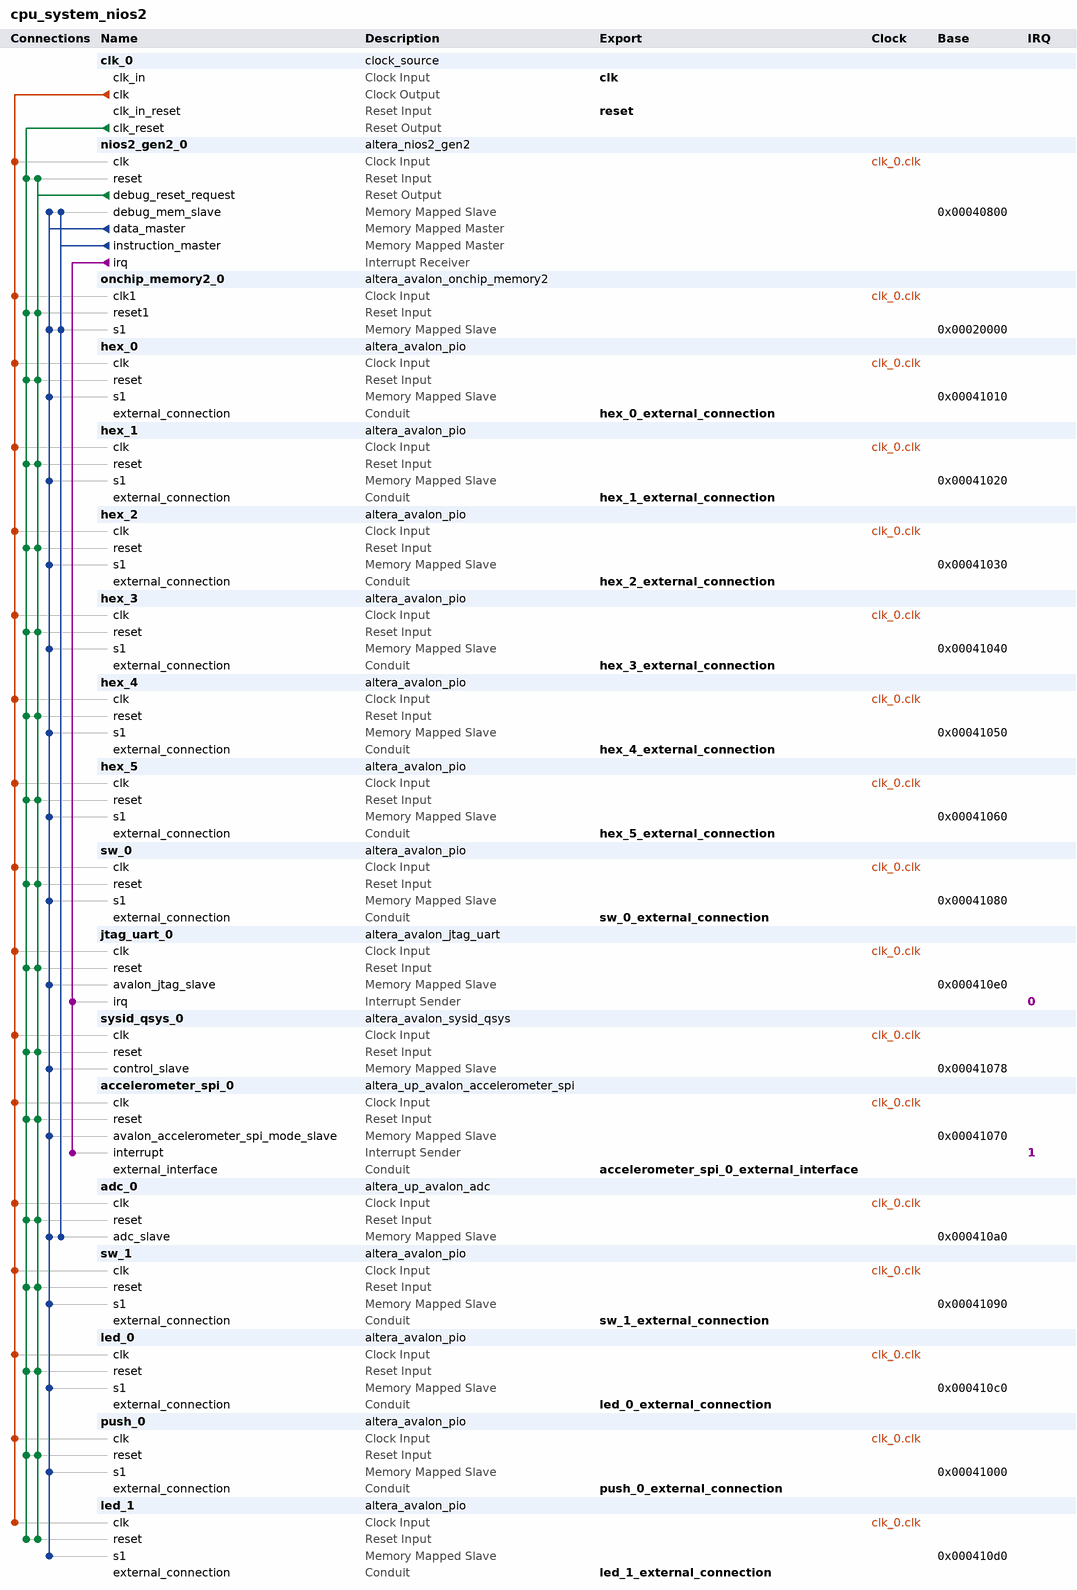
[diagram p0: system contents]
# Platform Designer (Qsys) system cpu_system_nios2, MAX 10 10M50DAF484C7G
# Parameters at their usual value, and those the tool derives, are not listed.
package require -exact qsys 22.1
create_system cpu_system_nios2
set_project_property DEVICE_FAMILY {MAX 10}
set_project_property DEVICE 10M50DAF484C7G

add_instance clk_0 clock_source 22.1
set_instance_parameter_value clk_0 clockFrequency 50000000

add_instance nios2_gen2_0 altera_nios2_gen2 22.1
set_instance_parameter_value nios2_gen2_0 dcache_size 0
set_instance_parameter_value nios2_gen2_0 exceptionSlave onchip_memory2_0.s1
set_instance_parameter_value nios2_gen2_0 icache_size 0
set_instance_parameter_value nios2_gen2_0 impl Fast
set_instance_parameter_value nios2_gen2_0 resetSlave onchip_memory2_0.s1

add_instance onchip_memory2_0 altera_avalon_onchip_memory2 22.1
set_instance_parameter_value onchip_memory2_0 dataWidth 32
set_instance_parameter_value onchip_memory2_0 dualPort false
set_instance_parameter_value onchip_memory2_0 initMemContent false
set_instance_parameter_value onchip_memory2_0 initializationFileName onchip_mem.hex
set_instance_parameter_value onchip_memory2_0 memorySize 131072

add_instance hex_0 altera_avalon_pio 22.1
set_instance_parameter_value hex_0 direction Output
set_instance_parameter_value hex_0 width 8

add_instance hex_1 altera_avalon_pio 22.1
set_instance_parameter_value hex_1 direction Output
set_instance_parameter_value hex_1 width 8

add_instance hex_2 altera_avalon_pio 22.1
set_instance_parameter_value hex_2 direction Output
set_instance_parameter_value hex_2 width 8

add_instance hex_3 altera_avalon_pio 22.1
set_instance_parameter_value hex_3 direction Output
set_instance_parameter_value hex_3 width 8

add_instance hex_4 altera_avalon_pio 22.1
set_instance_parameter_value hex_4 direction Output
set_instance_parameter_value hex_4 width 8

add_instance hex_5 altera_avalon_pio 22.1
set_instance_parameter_value hex_5 direction Output
set_instance_parameter_value hex_5 width 8

add_instance sw_0 altera_avalon_pio 22.1
set_instance_parameter_value sw_0 direction Input
set_instance_parameter_value sw_0 width 10

add_instance jtag_uart_0 altera_avalon_jtag_uart 22.1
set_instance_parameter_value jtag_uart_0 simInteractiveOptions NO_INTERACTIVE_WINDOWS

add_instance sysid_qsys_0 altera_avalon_sysid_qsys 22.1
set_instance_parameter_value sysid_qsys_0 id -559038737

add_instance accelerometer_spi_0 altera_up_avalon_accelerometer_spi 18.0

add_instance adc_0 altera_up_avalon_adc 18.0
set_instance_parameter_value adc_0 board DE10-Lite
set_instance_parameter_value adc_0 numch_ 1
set_instance_parameter_value adc_0 sclk_freq 10.0

add_instance sw_1 altera_avalon_pio 22.1
set_instance_parameter_value sw_1 direction Input
set_instance_parameter_value sw_1 width 10

add_instance led_0 altera_avalon_pio 22.1
set_instance_parameter_value led_0 direction Output
set_instance_parameter_value led_0 width 1

add_instance push_0 altera_avalon_pio 22.1
set_instance_parameter_value push_0 direction Input
set_instance_parameter_value push_0 width 1

add_instance led_1 altera_avalon_pio 22.1
set_instance_parameter_value led_1 direction Output
set_instance_parameter_value led_1 width 1

# connections
add_connection clk_0.clk accelerometer_spi_0.clk clock
add_connection clk_0.clk adc_0.clk clock
add_connection clk_0.clk hex_0.clk clock
add_connection clk_0.clk hex_1.clk clock
add_connection clk_0.clk hex_2.clk clock
add_connection clk_0.clk hex_3.clk clock
add_connection clk_0.clk hex_4.clk clock
add_connection clk_0.clk hex_5.clk clock
add_connection clk_0.clk jtag_uart_0.clk clock
add_connection clk_0.clk led_0.clk clock
add_connection clk_0.clk led_1.clk clock
add_connection clk_0.clk nios2_gen2_0.clk clock
add_connection clk_0.clk onchip_memory2_0.clk1 clock
add_connection clk_0.clk push_0.clk clock
add_connection clk_0.clk sw_0.clk clock
add_connection clk_0.clk sw_1.clk clock
add_connection clk_0.clk sysid_qsys_0.clk clock
add_connection clk_0.clk_reset accelerometer_spi_0.reset reset
add_connection clk_0.clk_reset adc_0.reset reset
add_connection clk_0.clk_reset hex_0.reset reset
add_connection clk_0.clk_reset hex_1.reset reset
add_connection clk_0.clk_reset hex_2.reset reset
add_connection clk_0.clk_reset hex_3.reset reset
add_connection clk_0.clk_reset hex_4.reset reset
add_connection clk_0.clk_reset hex_5.reset reset
add_connection clk_0.clk_reset jtag_uart_0.reset reset
add_connection clk_0.clk_reset led_0.reset reset
add_connection clk_0.clk_reset led_1.reset reset
add_connection clk_0.clk_reset nios2_gen2_0.reset reset
add_connection clk_0.clk_reset onchip_memory2_0.reset1 reset
add_connection clk_0.clk_reset push_0.reset reset
add_connection clk_0.clk_reset sw_0.reset reset
add_connection clk_0.clk_reset sw_1.reset reset
add_connection clk_0.clk_reset sysid_qsys_0.reset reset
add_connection nios2_gen2_0.debug_reset_request accelerometer_spi_0.reset reset
add_connection nios2_gen2_0.debug_reset_request adc_0.reset reset
add_connection nios2_gen2_0.debug_reset_request hex_0.reset reset
add_connection nios2_gen2_0.debug_reset_request hex_1.reset reset
add_connection nios2_gen2_0.debug_reset_request hex_2.reset reset
add_connection nios2_gen2_0.debug_reset_request hex_3.reset reset
add_connection nios2_gen2_0.debug_reset_request hex_4.reset reset
add_connection nios2_gen2_0.debug_reset_request hex_5.reset reset
add_connection nios2_gen2_0.debug_reset_request jtag_uart_0.reset reset
add_connection nios2_gen2_0.debug_reset_request led_0.reset reset
add_connection nios2_gen2_0.debug_reset_request led_1.reset reset
add_connection nios2_gen2_0.debug_reset_request nios2_gen2_0.reset reset
add_connection nios2_gen2_0.debug_reset_request onchip_memory2_0.reset1 reset
add_connection nios2_gen2_0.debug_reset_request push_0.reset reset
add_connection nios2_gen2_0.debug_reset_request sw_0.reset reset
add_connection nios2_gen2_0.debug_reset_request sw_1.reset reset
add_connection nios2_gen2_0.debug_reset_request sysid_qsys_0.reset reset
add_connection nios2_gen2_0.data_master accelerometer_spi_0.avalon_accelerometer_spi_mode_slave avalon
set_connection_parameter_value nios2_gen2_0.data_master/accelerometer_spi_0.avalon_accelerometer_spi_mode_slave baseAddress 0x00041070
add_connection nios2_gen2_0.data_master adc_0.adc_slave avalon
set_connection_parameter_value nios2_gen2_0.data_master/adc_0.adc_slave baseAddress 0x000410a0
add_connection nios2_gen2_0.data_master hex_0.s1 avalon
set_connection_parameter_value nios2_gen2_0.data_master/hex_0.s1 baseAddress 0x00041010
add_connection nios2_gen2_0.data_master hex_1.s1 avalon
set_connection_parameter_value nios2_gen2_0.data_master/hex_1.s1 baseAddress 0x00041020
add_connection nios2_gen2_0.data_master hex_2.s1 avalon
set_connection_parameter_value nios2_gen2_0.data_master/hex_2.s1 baseAddress 0x00041030
add_connection nios2_gen2_0.data_master hex_3.s1 avalon
set_connection_parameter_value nios2_gen2_0.data_master/hex_3.s1 baseAddress 0x00041040
add_connection nios2_gen2_0.data_master hex_4.s1 avalon
set_connection_parameter_value nios2_gen2_0.data_master/hex_4.s1 baseAddress 0x00041050
add_connection nios2_gen2_0.data_master hex_5.s1 avalon
set_connection_parameter_value nios2_gen2_0.data_master/hex_5.s1 baseAddress 0x00041060
add_connection nios2_gen2_0.data_master jtag_uart_0.avalon_jtag_slave avalon
set_connection_parameter_value nios2_gen2_0.data_master/jtag_uart_0.avalon_jtag_slave baseAddress 0x000410e0
add_connection nios2_gen2_0.data_master led_0.s1 avalon
set_connection_parameter_value nios2_gen2_0.data_master/led_0.s1 baseAddress 0x000410c0
add_connection nios2_gen2_0.data_master led_1.s1 avalon
set_connection_parameter_value nios2_gen2_0.data_master/led_1.s1 baseAddress 0x000410d0
add_connection nios2_gen2_0.data_master nios2_gen2_0.debug_mem_slave avalon
set_connection_parameter_value nios2_gen2_0.data_master/nios2_gen2_0.debug_mem_slave baseAddress 0x00040800
add_connection nios2_gen2_0.data_master onchip_memory2_0.s1 avalon
set_connection_parameter_value nios2_gen2_0.data_master/onchip_memory2_0.s1 baseAddress 0x00020000
add_connection nios2_gen2_0.data_master push_0.s1 avalon
set_connection_parameter_value nios2_gen2_0.data_master/push_0.s1 baseAddress 0x00041000
add_connection nios2_gen2_0.data_master sw_0.s1 avalon
set_connection_parameter_value nios2_gen2_0.data_master/sw_0.s1 baseAddress 0x00041080
add_connection nios2_gen2_0.data_master sw_1.s1 avalon
set_connection_parameter_value nios2_gen2_0.data_master/sw_1.s1 baseAddress 0x00041090
add_connection nios2_gen2_0.data_master sysid_qsys_0.control_slave avalon
set_connection_parameter_value nios2_gen2_0.data_master/sysid_qsys_0.control_slave baseAddress 0x00041078
add_connection nios2_gen2_0.instruction_master adc_0.adc_slave avalon
set_connection_parameter_value nios2_gen2_0.instruction_master/adc_0.adc_slave baseAddress 0x000410a0
add_connection nios2_gen2_0.instruction_master nios2_gen2_0.debug_mem_slave avalon
set_connection_parameter_value nios2_gen2_0.instruction_master/nios2_gen2_0.debug_mem_slave baseAddress 0x00040800
add_connection nios2_gen2_0.instruction_master onchip_memory2_0.s1 avalon
set_connection_parameter_value nios2_gen2_0.instruction_master/onchip_memory2_0.s1 baseAddress 0x00020000
add_connection nios2_gen2_0.irq accelerometer_spi_0.interrupt interrupt
set_connection_parameter_value nios2_gen2_0.irq/accelerometer_spi_0.interrupt irqNumber 1
add_connection nios2_gen2_0.irq jtag_uart_0.irq interrupt
set_connection_parameter_value nios2_gen2_0.irq/jtag_uart_0.irq irqNumber 0

# exported interfaces
add_interface accelerometer_spi_0_external_interface conduit end
set_interface_property accelerometer_spi_0_external_interface EXPORT_OF accelerometer_spi_0.external_interface
add_interface clk clock sink
set_interface_property clk EXPORT_OF clk_0.clk_in
add_interface hex_0_external_connection conduit end
set_interface_property hex_0_external_connection EXPORT_OF hex_0.external_connection
add_interface hex_1_external_connection conduit end
set_interface_property hex_1_external_connection EXPORT_OF hex_1.external_connection
add_interface hex_2_external_connection conduit end
set_interface_property hex_2_external_connection EXPORT_OF hex_2.external_connection
add_interface hex_3_external_connection conduit end
set_interface_property hex_3_external_connection EXPORT_OF hex_3.external_connection
add_interface hex_4_external_connection conduit end
set_interface_property hex_4_external_connection EXPORT_OF hex_4.external_connection
add_interface hex_5_external_connection conduit end
set_interface_property hex_5_external_connection EXPORT_OF hex_5.external_connection
add_interface led_0_external_connection conduit end
set_interface_property led_0_external_connection EXPORT_OF led_0.external_connection
add_interface led_1_external_connection conduit end
set_interface_property led_1_external_connection EXPORT_OF led_1.external_connection
add_interface push_0_external_connection conduit end
set_interface_property push_0_external_connection EXPORT_OF push_0.external_connection
add_interface reset reset sink
set_interface_property reset EXPORT_OF clk_0.clk_in_reset
add_interface sw_0_external_connection conduit end
set_interface_property sw_0_external_connection EXPORT_OF sw_0.external_connection
add_interface sw_1_external_connection conduit end
set_interface_property sw_1_external_connection EXPORT_OF sw_1.external_connection

set_interconnect_requirement {$system} qsys_mm.clockCrossingAdapter HANDSHAKE
set_interconnect_requirement {$system} qsys_mm.enableEccProtection FALSE
set_interconnect_requirement {$system} qsys_mm.insertDefaultSlave FALSE
set_interconnect_requirement {$system} qsys_mm.maxAdditionalLatency 1

save_system cpu_system_nios2.qsys
